# Altium schematic sheet GPIO_OUT.SchDoc
size A4; DocumentNumber: 15; SheetNumber: 15; SheetTotal: 15
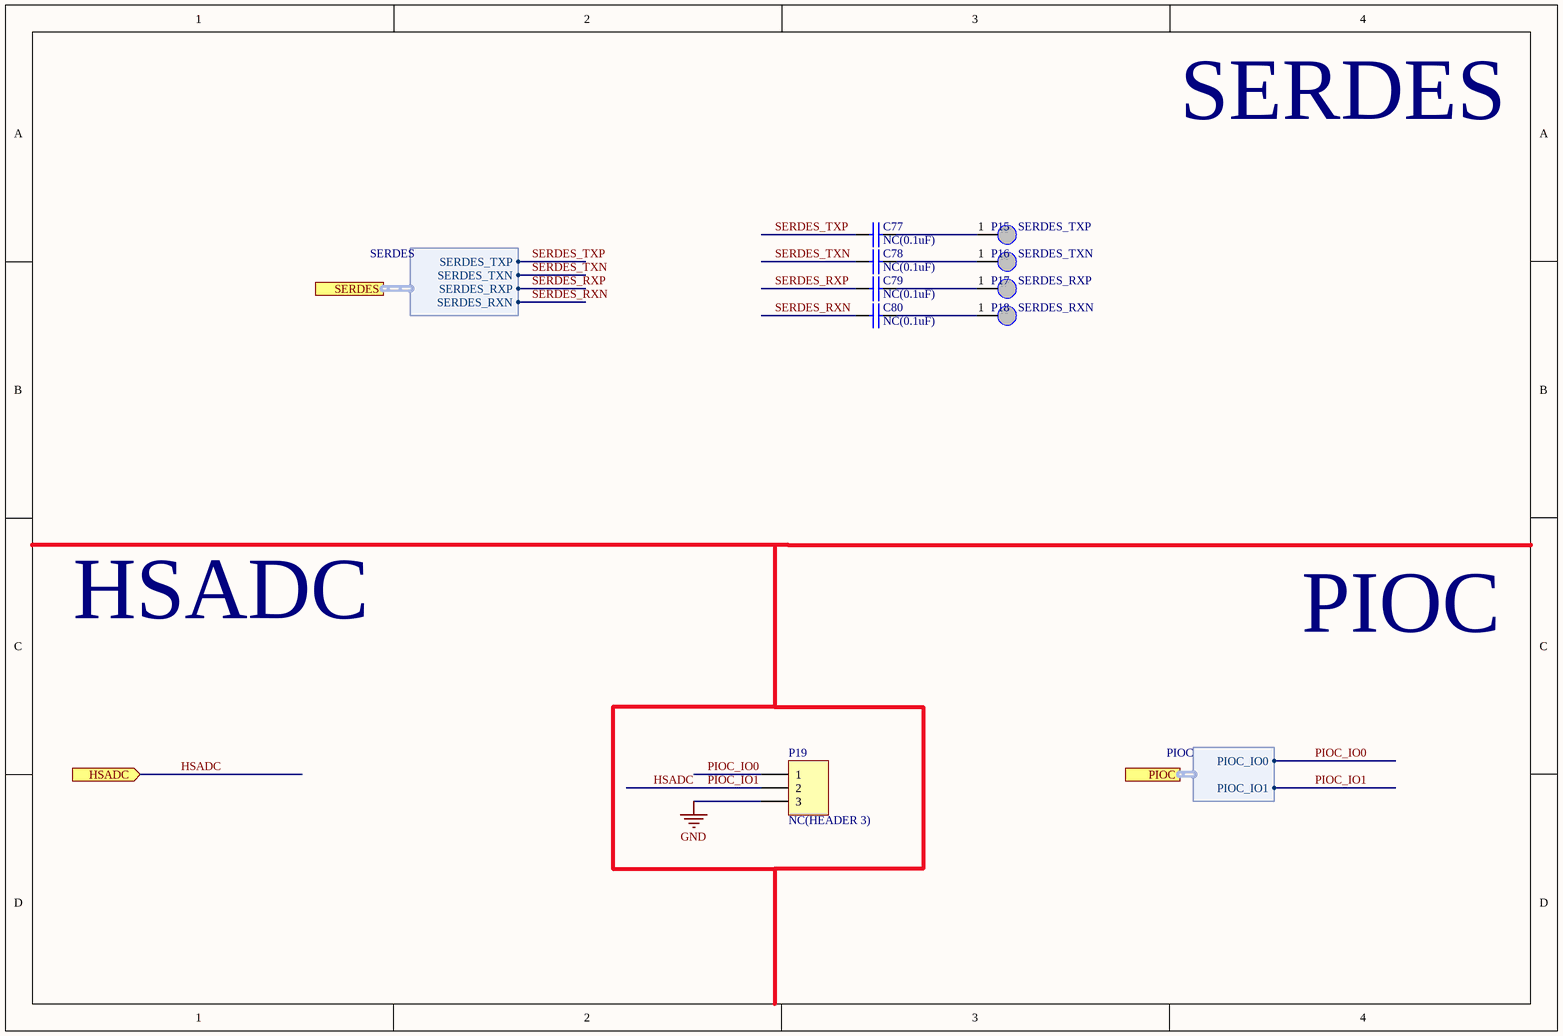
[diagram p0: GPIO_OUT.SchDoc]

## Parts
C77  NC(0.1uF)  [0402_C]
C78  NC(0.1uF)  [0402_C]
C79  NC(0.1uF)  [0402_C]
C80  NC(0.1uF)  [0402_C]
P15  SERDES_TXP  [TESTPOINT1]
P16  SERDES_TXN  [TESTPOINT1]
P17  SERDES_RXP  [TESTPOINT1]
P18  SERDES_RXN  [TESTPOINT1]
P19  NC(HEADER 3)  [SIP3-2.54MM]

## Ports
HSADC (in), PIOC (harness PIOC), SERDES (harness SERDES)

## Harnesses
PIOC: PIOC_IO0, PIOC_IO1
SERDES: SERDES_TXP, SERDES_TXN, SERDES_RXP, SERDES_RXN

## Nets
GND: P19.3
HSADC: P19.2 ; port HSADC, port PIOC.PIOC_IO1  [also labelled PIOC_IO1]
PIOC_IO0: P19.1 ; port PIOC.PIOC_IO0
SERDES_RXN: C80.1 ; port SERDES.SERDES_RXN
SERDES_RXP: C79.1 ; port SERDES.SERDES_RXP
SERDES_TXN: C78.1 ; port SERDES.SERDES_TXN
SERDES_TXP: C77.1 ; port SERDES.SERDES_TXP
NetC77_2: C77.2 P15.1
NetC78_2: C78.2 P16.1
NetC79_2: C79.2 P17.1
NetC80_2: C80.2 P18.1

## Notes on the sheet
- SERDES
- HSADC
- PIOC

## Library data of the parts
C77-C80 = CAP: Capacitor
P15-P18 = PAD: 焊盘
P19 = HEADER 3: Header, 3-Pin